# EAGLE design tick-mk-4 (EAGLE 6.5.0)
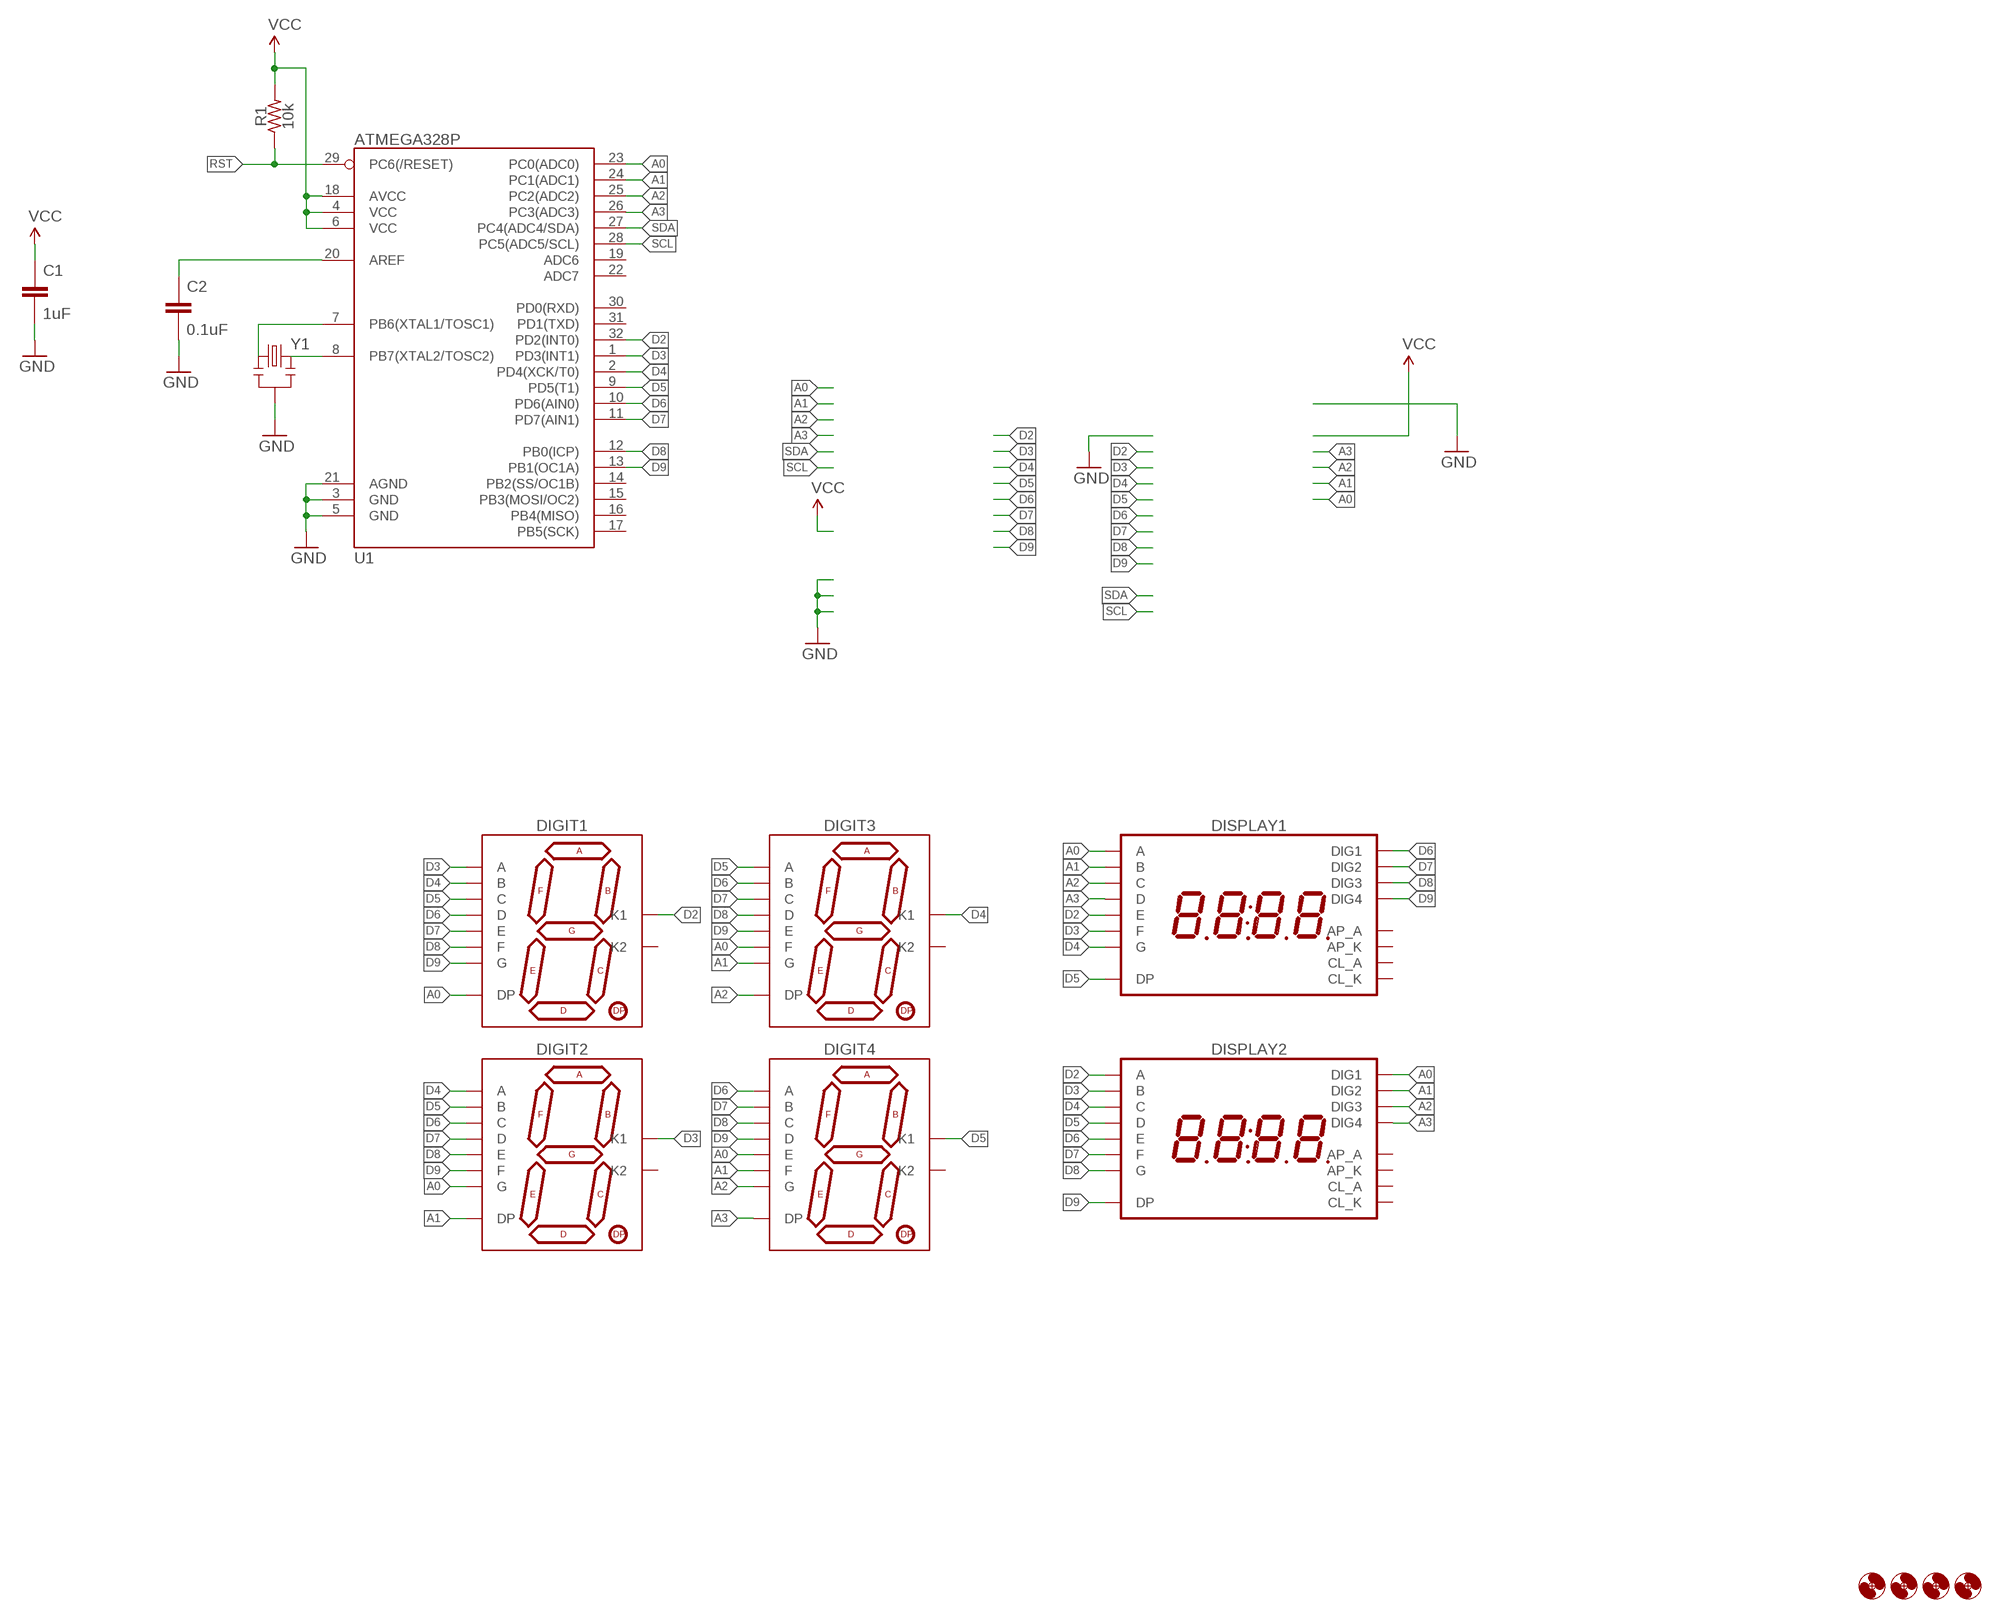
[diagram p0: schematic, sheet 1]

## Parts
C1  1uF  CAPACITOR-CERAMICC0805  [C0805]
C2  0.1uF  CAPACITOR-CERAMICC0805  [C0805]
DIGIT1  7SEG_1DIGPTH-25.4MM  [7SEG_1DIG_25.4MM]
DIGIT2  7SEG_1DIGPTH-25.4MM  [7SEG_1DIG_25.4MM]
DIGIT3  7SEG_1DIGPTH-25.4MM  [7SEG_1DIG_25.4MM]
DIGIT4  7SEG_1DIGPTH-25.4MM  [7SEG_1DIG_25.4MM]
DISPLAY1  7SEG_4DIGIT_COLON_APOS  [7SEG_4DIG_10MM]
DISPLAY2  7SEG_4DIGIT_COLON_APOS  [7SEG_4DIG_10MM]
H1  HOLE#2  [HOLE-#2]
H2  HOLE#2  [HOLE-#2]
H3  HOLE#2  [HOLE-#2]
H4  HOLE#2  [HOLE-#2]
R1  10k  RESISTORR0805  [R0805]
U1  ATMEGA328P  ATMEGA328_SMT  [TQFP32-08]
Y1  RESONATORSMD-4.7X4.1X1.2  [RESONATOR-4.7X4.1X1.2MM]

## Nets
A0: DIGIT1.5(DP) DIGIT2.10(G) DIGIT3.9(F) DIGIT4.1(E) DISPLAY1.14(A) DISPLAY2.1(DIG1) U1.23(PC0(ADC0))
A1: DIGIT2.5(DP) DIGIT3.10(G) DIGIT4.9(F) DISPLAY1.16(B) DISPLAY2.2(DIG2) U1.24(PC1(ADC1))
A2: DIGIT3.5(DP) DIGIT4.10(G) DISPLAY1.13(C) DISPLAY2.6(DIG3) U1.25(PC2(ADC2))
A3: DIGIT4.5(DP) DISPLAY1.3(D) DISPLAY2.8(DIG4) U1.26(PC3(ADC3))
D2: DIGIT1.3(K1) DISPLAY1.5(E) DISPLAY2.14(A) U1.32(PD2(INT0))
D3: DIGIT1.7(A) DIGIT2.3(K1) DISPLAY1.11(F) DISPLAY2.16(B) U1.1(PD3(INT1))
D4: DIGIT1.6(B) DIGIT2.7(A) DIGIT3.3(K1) DISPLAY1.15(G) DISPLAY2.13(C) U1.2(PD4(XCK/T0))
D5: DIGIT1.4(C) DIGIT2.6(B) DIGIT3.7(A) DIGIT4.3(K1) DISPLAY1.7(DP) DISPLAY2.3(D) U1.9(PD5(T1))
D6: DIGIT1.2(D) DIGIT2.4(C) DIGIT3.6(B) DIGIT4.7(A) DISPLAY1.1(DIG1) DISPLAY2.5(E) U1.10(PD6(AIN0))
D7: DIGIT1.1(E) DIGIT2.2(D) DIGIT3.4(C) DIGIT4.6(B) DISPLAY1.2(DIG2) DISPLAY2.11(F) U1.11(PD7(AIN1))
D8: DIGIT1.9(F) DIGIT2.1(E) DIGIT3.2(D) DIGIT4.4(C) DISPLAY1.6(DIG3) DISPLAY2.15(G) U1.12(PB0(ICP))
D9: DIGIT1.10(G) DIGIT2.9(F) DIGIT3.1(E) DIGIT4.2(D) DISPLAY1.8(DIG4) DISPLAY2.7(DP) U1.13(PB1(OC1A))
GND: C1.2 C2.2 U1.3(GND) U1.5(GND) U1.21(AGND) Y1.2
N$1: C2.1 U1.20(AREF)
N$2: U1.7(PB6(XTAL1/TOSC1)) Y1.1
N$3: U1.8(PB7(XTAL2/TOSC2)) Y1.3
RST: R1.1 U1.29(PC6(/RESET))
SCL: U1.28(PC5(ADC5/SCL))
SDA: U1.27(PC4(ADC4/SDA))
VCC: C1.1 R1.2 U1.4(VCC) U1.6(VCC) U1.18(AVCC)
Unconnected: DIGIT1.8(K2) DIGIT2.8(K2) DIGIT3.8(K2) DIGIT4.8(K2) DISPLAY1.4(CL_A) DISPLAY1.9(AP_K) DISPLAY1.10(AP_A) DISPLAY1.12(CL_K) DISPLAY2.4(CL_A) DISPLAY2.9(AP_K) DISPLAY2.10(AP_A) DISPLAY2.12(CL_K) U1.14(PB2(SS/OC1B)) U1.15(PB3(MOSI/OC2)) U1.16(PB4(MISO)) U1.17(PB5(SCK)) U1.19(ADC6) U1.22(ADC7) U1.30(PD0(RXD)) U1.31(PD1(TXD))

## Library data of the parts
C1 C2 = A_butts:CAPACITOR-CERAMIC: CAPACITOR, European symbol
DIGIT1-DIGIT4 = A_butts:7SEG_1DIG
DISPLAY1 DISPLAY2 = A_butts:7SEG_4DIGIT_COLON_APOS
H1-H4 = A_butts:HOLE: MOUNTING HOLE with drill center marker
R1 = A_butts:RESISTOR: RESISTOR, American symbol
U1 = A_butts:ATMEGA328_SMT: 32-Pin Atmega328 part Commonly used on Arduino compatible boards Available in QFP and QFN packages TQFP is IC-09069 QFN is non-stock; PROD_ID: IC-09069
Y1 = A_butts:RESONATOR: Resonator Small SMD resonator. Used, eg, on the Arduino Pro/ Pro Mini boards. 8MHz- XTAL-08895 16MHz- XTAL-08900

## Board
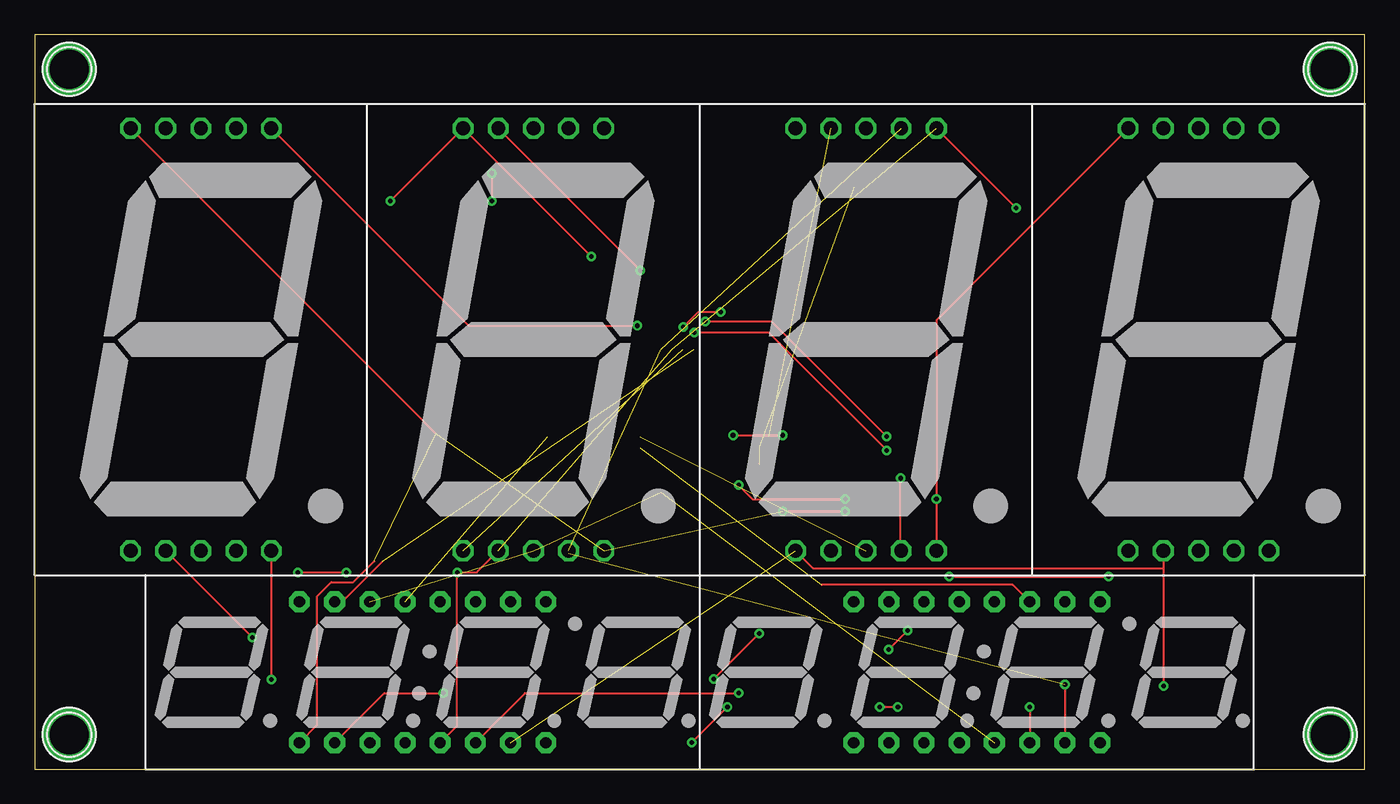
[diagram p1: board, top side]
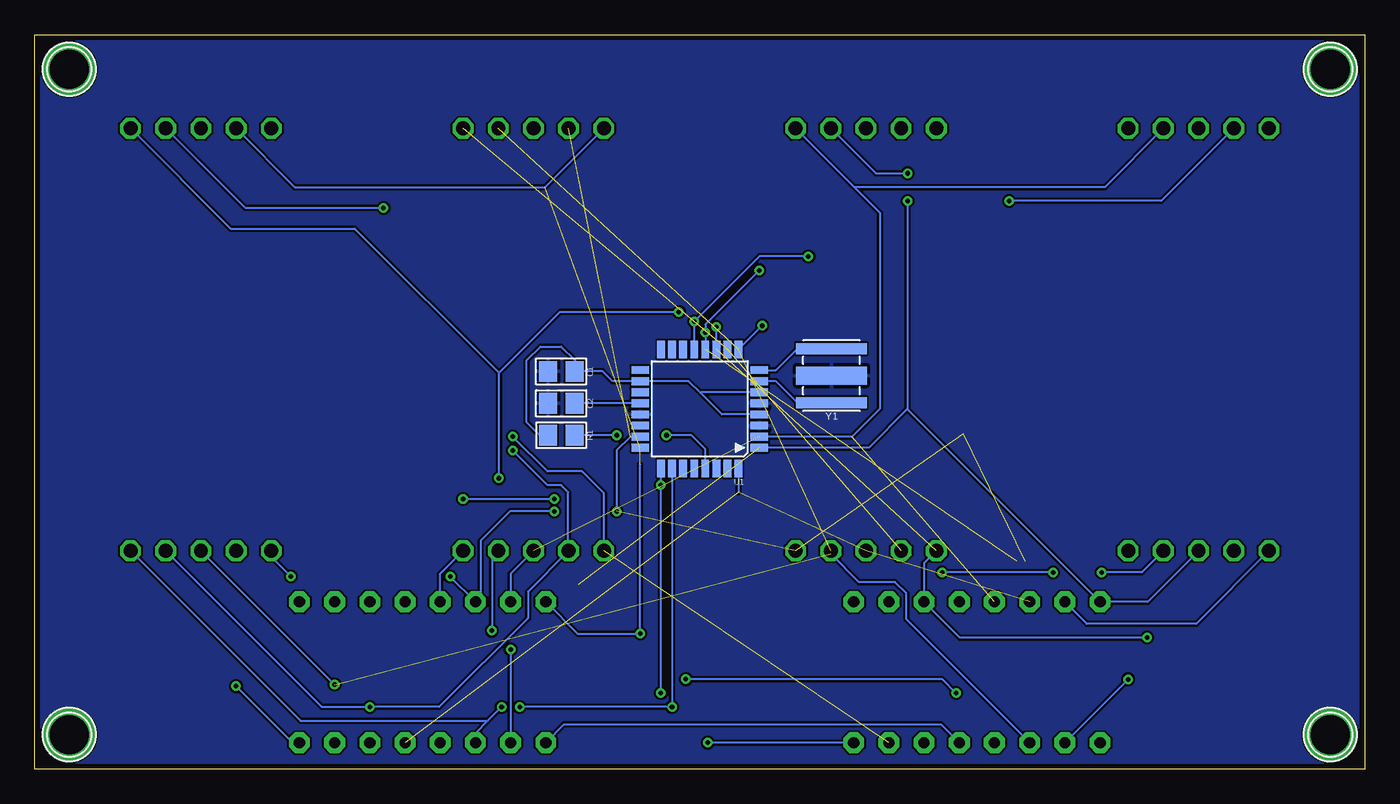
[diagram p2: board, bottom side, seen from below]

Size 96 x 53 mm. Coordinates in mm from the lower left corner, seen from the top.
Outline: 96,0 96,53 0,53 0,0 96,0
Copper layers (1*16): Top 0.0356mm / dielectric 1.5011mm / Bottom 0.0356mm
Design rules "LaenPCBOrder2": minimum track width 6mil, minimum drill 13mil, track to track 6mil, track to pad 6mil, pad to pad 6mil, via to via 6mil, smd to smd 6mil, copper to edge 15mil, drill to drill 6mil, minimum pad ring 7mil, minimum via ring 7mil, stop-mask expansion 3mil, vias tented up to drill 20mil, thermal gap 10mil

### Footprints (pad centres in the part's own frame; a part is rotated, then mirrored left to right if it is on the bottom)
C0805 = smd 1.3 x 1.5: 1 -0.95,0; 2 0.95,0
7SEG_1DIG_25.4MM = drill 1 pad 1.5 octagon: 1 -5.08,-15.24; 2 -2.54,-15.24; 3 0,-15.24; 4 2.54,-15.24; 5 5.08,-15.24; 6 5.08,15.24; 7 2.54,15.24; 8 0,15.24; 9 -2.54,15.24; 10 -5.08,15.24
7SEG_4DIG_10MM = drill 0.8 pad 1.5 octagon: 1 -8.89,-5.08; 2 -6.35,-5.08; 3 -3.81,-5.08; 4 -1.27,-5.08; 5 1.27,-5.08; 6 3.81,-5.08; 7 6.35,-5.08; 8 8.89,-5.08; 9 8.89,5.08; 10 6.35,5.08; 11 3.81,5.08; 12 1.27,5.08; 13 -1.27,5.08; 14 -3.81,5.08; 15 -6.35,5.08; 16 -8.89,5.08
HOLE-#2 = drill 2.8 pad 3.81: P$1 0,0
R0805 = smd 1.3 x 1.5: 1 -0.95,0; 2 0.95,0
TQFP32-08 = smd 1.27 x 0.559: 1 -4.293,2.8; 2 -4.293,2; 3 -4.293,1.2; 4 -4.293,0.4; 5 -4.293,-0.4; 6 -4.293,-1.2; 7 -4.293,-2; 8 -4.293,-2.8; 17 4.293,-2.8; 18 4.293,-2; 19 4.293,-1.2; 20 4.293,-0.4; 21 4.293,0.4; 22 4.293,1.2; 23 4.293,2; 24 4.293,2.8 | smd 0.559 x 1.27: 9 -2.8,-4.293; 10 -2,-4.293; 11 -1.2,-4.293; 12 -0.4,-4.293; 13 0.4,-4.293; 14 1.2,-4.293; 15 2,-4.293; 16 2.8,-4.293; 25 2.8,4.293; 26 2,4.293; 27 1.2,4.293; 28 0.4,4.293; 29 -0.4,4.293; 30 -1.2,4.293; 31 -2,4.293; 32 -2.8,4.293
RESONATOR-4.7X4.1X1.2MM = smd 0.8 x 5.1: 1 -1.95,0; 3 1.95,0 | smd 1.3 x 5.1: 2 0,0

### Placement (x,y rotation side)
C1  58,28.7 180 bottom
C2  58,26.4 180 bottom
DIGIT1  36,31 0 top
DIGIT2  12,31 0 top
DIGIT3  60,31 0 top
DIGIT4  84,31 0 top
DISPLAY1  68,7 0 top
DISPLAY2  28,7 0 top
H1  2.5,2.5 0 top
H2  2.5,50.5 0 top
H3  93.5,2.5 0 top
H4  93.5,50.5 0 top
R1  58,24.1 180 bottom
U1  48,26 180 bottom
Y1  38.5,28.4 90 bottom

### Tracks (layer width: path | path; a pad name or v marks a point on that pad's centre or on a via)
A0  (via drill 0.33)  (4 unrouted)
  Top 0.152: DIGIT2.10 28.96,24.2 | v66.01,13.9 v77.5,13.9 | DISPLAY2.1 20.4,3.21 20.4,12.5 21.4,13.5 23,13.5 24.5,15 | v54,18.6 v58.5,18.6
  Bottom 0.152: U1.23 53,24 54,23 v54,18.6 | v66.01,13.9 DISPLAY1.14 63.8,12.47 63.8,16.5 61.7,18.6 v58.5,18.6 | v77.5,13.9 78.92,15.32 DIGIT4.1
A1  (via drill 0.33)  (2 unrouted)
  Top 0.152: DIGIT2.5 v17.08,6.49 | DISPLAY2.2 25.23,5.5 v29.5,5.5 | v49,6.5 v52.3,9.8
  Bottom 0.152: DIGIT4.9 77.22,42 59.16,42 DIGIT3.10 | v17.08,6.49 DISPLAY2.2 | v29.5,5.5 30.5,6.5 v49,6.5 | v52.3,9.8 v52.29,9.79 | DISPLAY1.16 56.82,9.79 v52.29,9.79 | v52.29,9.79 52.29,22
A2  (via drill 0.33)
  Top 0.152: DIGIT4.10 65.08,32.4 v65.08,19.5 DIGIT3.5 | DISPLAY2.6 35.39,5.5 v50.8,5.5 | v50.8,20.5 51.8,19.5 v58.5,19.5
  Bottom 0.152: DISPLAY1.13 66.73,14.11 DIGIT3.5 | v50.8,5.5 v50.8,20.5 U1.25 | v58.5,19.5 v65.08,19.5
A3  (via drill 0.33)
  Top 0.152: v47.42,1.92 v50,4.5 | v61,4.5 v62.3,4.5
  Bottom 0.152: DIGIT4.5 76.82,3.5 63.3,3.5 | U1.26 v50,4.5 v61,4.5 | DISPLAY2.8 v47.42,1.92 | v62.3,4.5 63.3,3.5 | DISPLAY1.3 64.19,2.61 63.3,3.5
D2  (3 unrouted)
  Bottom 0.152: U1.32 45.2,20
D3  (via drill 0.33)  (1 unrouted)
  Top 0.152: v33,43 v33,41 | DISPLAY1.11 70.59,13.3 56.8,13.3
  Bottom 0.152: DIGIT1.7 35.3,43 v33,43 | v33,41 33,26 | 33,26 35.8,23.2 U1.1 | 33,26 33,25.97 DISPLAY2.16 15.68,12.08 DIGIT2.3
D4  (2 unrouted)
  Bottom 0.152: DIGIT2.7 18.78,42 36.84,42 | 36.84,42 DIGIT1.6 | 36.84,42 35,40.16 35,26 37,24 U1.2 | DIGIT3.3 61.65,14.11 DISPLAY1.15
D5  (via drill 0.33)  (3 unrouted)
  Top 0.152: DIGIT2.6 31.32,32 v43.5,32 | v74.35,6.11 DISPLAY1.7
  Bottom 0.152: v43.5,32 U1.9 | DIGIT4.3 v74.35,6.11 | DISPLAY2.3 33.1,10.83 33.1,12.7 33.9,13.5 36.5,13.5 38.54,15.54 DIGIT1.4
D6  (via drill 0.33)  (2 unrouted)
  Top 0.152: v70.82,40.5 DIGIT3.6 | DIGIT1.2 31.9,14.2 v30.5,14.2 30.5,3.15 DISPLAY2.5 | v19,14.2 v22.5,14.2
  Bottom 0.152: DIGIT4.7 80.8,40.5 v70.82,40.5 | DIGIT2.4 16.1,14.2 v19,14.2 | DISPLAY1.1 57.78,3.25 30.6,3.25 DISPLAY2.5 | v22.5,14.2 v30.5,14.2
D7  (via drill 0.33)  (1 unrouted)
  Top 0.152: DIGIT2.2 v15.72,9.5 | v63,10 v61.65,8.65 | DIGIT3.4 62.5,15.8 v62.5,21 | v46.8,31.9 47.9,33 v49.5,33
  Bottom 0.152: DIGIT1.1 31.81,14.87 DISPLAY2.11 29.23,9.5 v15.72,9.5 | DIGIT4.6 81.84,39 72.9,39 62.5,28.6 | U1.11 v46.8,31.9 | DIGIT3.4 63,15.3 v63,10 | v61.65,8.65 DISPLAY1.2 | v62.5,21 62.5,28.6 | 62.5,28.6 58.1,33 v49.5,33
D8  (via drill 0.33)  (1 unrouted)
  Top 0.152: v71.81,4.5 DISPLAY1.6 | DISPLAY2.15 22.18,12.08 25.1,15 | v61.5,23 53,31.5 v47.6,31.5 | DIGIT1.9 v43.7,36
  Bottom 0.152: U1.12 v47.6,31.5 47.6,32.1 v43.7,36 | DIGIT2.1 12.18,10.5 20.07,10.5 DISPLAY2.15 | DIGIT4.4 75.28,4.5 v71.81,4.5 66.8,4.5 60.4,10.9 60.4,12.82 DIGIT3.2 57.5,15.8 57.5,20 58,20.5 59,20.5 v61.5,23
D9  (via drill 0.33)  (1 unrouted)
  Top 0.152: v40.16,37 DIGIT1.10 v25.68,41 | DIGIT4.2 81.46,14.5 | 81.46,14.5 v81.46,6 | DIGIT3.1 56.18,14.5 81.46,14.5 | v61.5,24 53.2,32.3 v48.4,32.3
  Bottom 0.152: DIGIT2.9 14.7,41 v25.68,41 | v40.16,37 43.7,37 v48.4,32.3 U1.13 | v81.46,6 77.38,1.92 DISPLAY1.8 | DIGIT3.1 54.92,19.92 56.5,21.5 59,21.5 v61.5,24
GND
  pour Bottom: 0,53 96,53 96,0 0,0
N$1
  Bottom 0.152: U1.20 C2.1
N$2
  Bottom 0.152: Y1.1 40.95,26.45 42.5,28 U1.7
N$3
  Bottom 0.152: Y1.3 40.95,30.35 42.5,28.8 U1.8
RST  (via drill 0.33)
  Top 0.152: v50.4,24.1 v54,24.1
  Bottom 0.152: v54,24.1 R1.1 | U1.29 47.6,23.1 48.6,24.1 v50.4,24.1
VCC
  Bottom 0.152: U1.4 46.4,25.6 47.95,27.15 | 47.95,27.15 48.8,28 U1.18 54.3,28 55,28.7 C1.1 57,28.75 57,29.5 58,30.5 59.5,30.5 60.5,29.5 60.5,25.05 59.55,24.1 R1.2 | U1.6 47.9,27.2 47.95,27.15